# EAGLE design OLC (EAGLE 9.6.2)
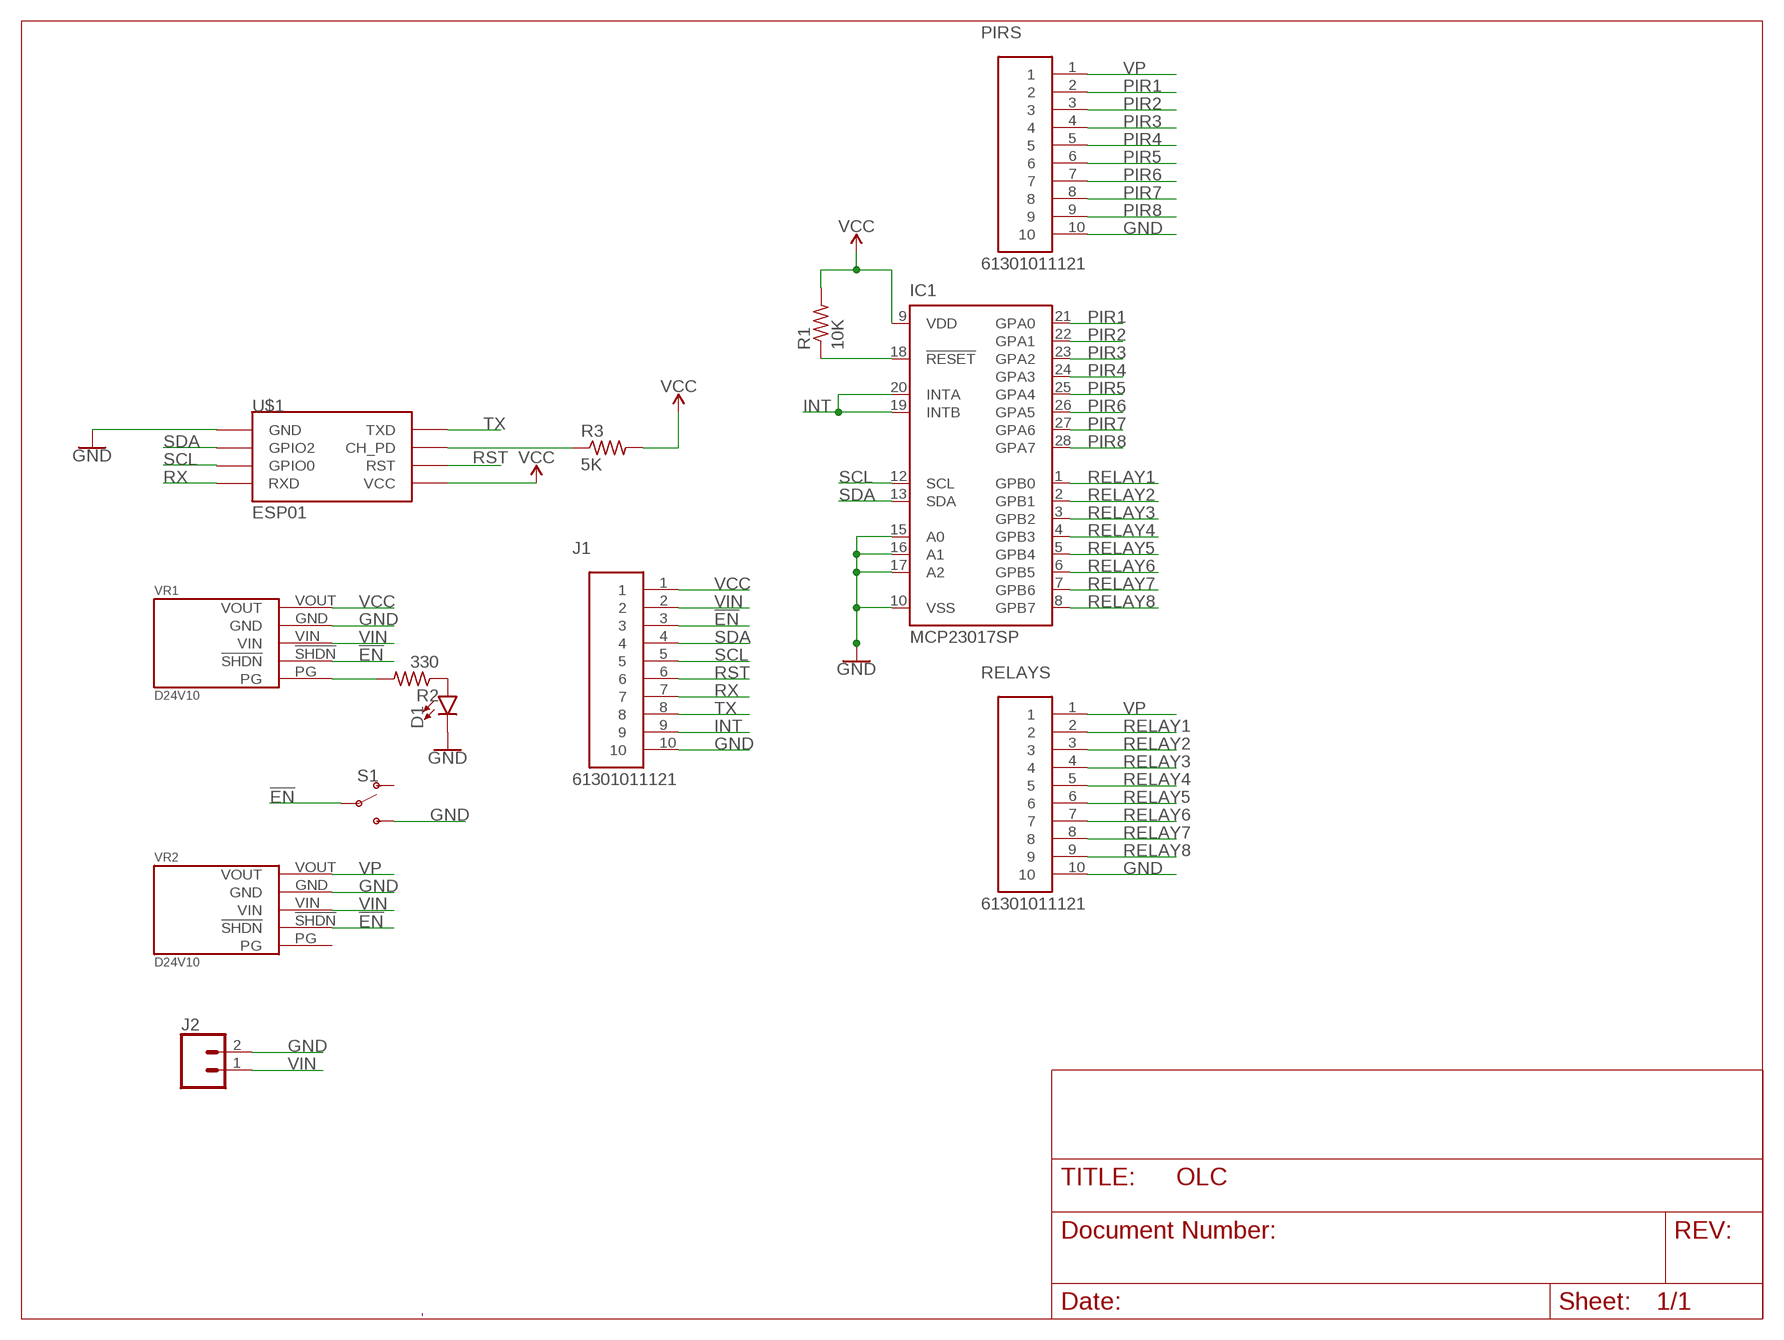
[diagram p0: schematic, sheet 1]

## Parts
D1  LED5MM-KIT  [LED_5MM-KIT]
IC1  MCP23017SP  [DIL28-3]
J1  61301011121  [61301011121]
J2  CONN_023.5MM  [SCREWTERMINAL-3.5MM-2]
PIRS  61301011121  [61301011121]
R1  10K  R-US_0207/10  [0207/10]
R2  330  R-US_0207/10  [0207/10]
R3  5K  R-US_0207/10  [0207/10]
RELAYS  61301011121  [61301011121]
S1  SWITCH-SPDT-PTH-11.6X4.0MM  [SWITCH_SPDT_PTH_11.6X4.0MM]
U$1  ESP01  [ESP01]
VR1  D24V10  [D24V10]
VR2  D24V10  [D24V10]

## Nets
!EN: J1.3 S1.2(P) VR1.!SHDN VR2.!SHDN
GND: D1.K(C) IC1.10(VSS) IC1.15(A0) IC1.16(A1) IC1.17(A2) J1.10 J2.2 PIRS.10 RELAYS.10 S1.3(S) U$1.GND VR1.GND VR2.GND
INT: IC1.19(INTB) IC1.20(INTA) J1.9
N$1: IC1.18(!RESET) R1.1
N$2: D1.A R2.1
N$3: R2.2 VR1.PG
N$11: R3.1 U$1.CH_PD
PIR1: IC1.21(GPA0) PIRS.2
PIR2: IC1.22(GPA1) PIRS.3
PIR3: IC1.23(GPA2) PIRS.4
PIR4: IC1.24(GPA3) PIRS.5
PIR5: IC1.25(GPA4) PIRS.6
PIR6: IC1.26(GPA5) PIRS.7
PIR7: IC1.27(GPA6) PIRS.8
PIR8: IC1.28(GPA7) PIRS.9
RELAY1: IC1.1(GPB0) RELAYS.2
RELAY2: IC1.2(GPB1) RELAYS.3
RELAY3: IC1.3(GPB2) RELAYS.4
RELAY4: IC1.4(GPB3) RELAYS.5
RELAY5: IC1.5(GPB4) RELAYS.6
RELAY6: IC1.6(GPB5) RELAYS.7
RELAY7: IC1.7(GPB6) RELAYS.8
RELAY8: IC1.8(GPB7) RELAYS.9
RST: J1.6 U$1.RST
RX: J1.7 U$1.RX(RXD)
SCL: IC1.12(SCL) J1.5 U$1.GPIO0
SDA: IC1.13(SDA) J1.4 U$1.GPIO2
TX: J1.8 U$1.TX(TXD)
VCC: IC1.9(VDD) J1.1 R1.2 R3.2 U$1.VCC VR1.VOUT
VIN: J1.2 J2.1 VR1.VIN VR2.VIN
VP: PIRS.1 RELAYS.1 VR2.VOUT
Unconnected: S1.1(O) VR2.PG

## Library data of the parts
D1 = SparkFun-LED:LED: LED (Generic) Standard schematic elements and footprints for 5mm, 3mm, 1206, and 0603 sized LEDs. Generic LEDs with no color specified.
IC1 = microchip:MCP23017: http://ww1.microchip.com/downloads/en/DeviceDoc/21952a.pdf Source: http://ww1.microchip.com/downloads/en/DeviceDoc/21952a.pdf; MF: MICROCHIP; MPN: MCP23017-E/SP; OC_FARNELL: 1332088; OC_NEWARK: 31K2959
J1 PIRS RELAYS = Headers:61301011121: CONN HEADER VERT 10POS 2.54MM Manufacturer's datasheet <https://katalog.we-online.de/em/datasheet/6130xx11121.pdf>; CREATED_BY: PCBLayout.com; DIGIKEY_PART_NUMBER: 732-2670-ND; MANUFACTURER: Wurth Electronics Inc.; MPN: 61301011121
J2 = SparkFun-Connectors:CONN_02: Multi connection point. Often used as Generic Header-pin footprint for 0.1 inch spaced/style header connections On any of the 0.1 inch spaced packages, you can populate with these: Break Away Headers - Straight <https://www.sparkfun.com/products/116> (PRT-00116) Break Away Male Headers - Right Angle <https://www.sparkfun.com/products/553> (PRT-00553) Female Headers <https://www.sparkfun.com/products/115> (PRT-00115) Break Away Headers - Machine Pin <https://www.sparkfun.com/products/117> (PRT-00117) Break Away Female Headers - Swiss Machine Pin <https://www.sparkfun.com/products/743> (PRT-00743) For SCREWTERMINALS and SPRING TERMINALS visit here: Screw Terimnals on SparkFun.com <https://www.sparkfun.com/search/results?term=Screw+Terminals> (5mm/3.5mm/2.54mm spacing) This device is also useful as a general connection point to wire up your design to another part of your project. Our various solder wires solder well into these plated through hole pads. Hook-Up Wire - Assortment (Stranded, 22 AWG) <https://www.sparkfun.com/products/11375> (PRT-11375) Hook-Up Wire - Assortment (Solid Core, 22 AWG) <https://www.sparkfun.com/products/11367> (PRT-11367) View the entire wire category on our website here <https://www.sparkfun.com/categories/141> Special notes: Molex polarized connector foot print use with: PRT-08233 with associated crimp pins and housings. 2.54_SCREWTERM for use with PRT-10571. 3.5mm Screw Terminal footprints for PRT-08084 5mm Screw Terminal footprints for use with PRT-08432; PROD_ID: CONN-08399
R1-R3 = resistor:R-US_: RESISTOR, American symbol
S1 = SparkFun-Switches:SWITCH-SPDT: Single Pole, Double Throw (SPDT) Switch Single-pole, double-throw (SPDT) switch. Variant Overview SMD-AYZ0202 Surface Mount DPDT Switch <https://www.sparkfun.com/products/597> (COM-00597) Used on e.g. LilyPad Arduino USB - ATmega32U4 Board <https://www.sparkfun.com/products/12049> PTH-11.6X4.0MM SPDT Mini Power Switch <https://www.sparkfun.com/products/102> (COM-00102) Used on e.g. SparkFun Simon Says - Through-Hole Soldering Kit <https://www.sparkfun.com/products/10547> (KIT-10547) PTH-11.6X4.0MM-KIT KIT version of SPDT Mini Power Switch - Simplifies soldering by removing tStop of switch pins - only one side can be soldered. PTH-11.6X4.0MM-LOCK LOCK version of SPDT Mini Power Switch - Offset pins hold switch in place for easier soldering. SMD-RIGHT-ANGLE Surface Mount Right Angle Switch <https://www.sparkfun.com/products/10860> (COM-10860) Used on e.g. SparkFun ESP8266 Thing <https://www.sparkfun.com/products/13231>; PROD_ID: SWCH-08261; SF_SKU: COM-00102
U$1 = esp8266modules:ESP01: ESP8266 Wifi module 01
VR1 VR2 = Custom Parts:D24V10: Schematic for the D24V10 <https://www.pololu.com/category/248/d24v10fx-step-down-voltage-regulators> series regulators on Pololu <https://pololu.com>.

## Net classes
0 default: width 0.406 mm, clearance 0.203 mm

## Board
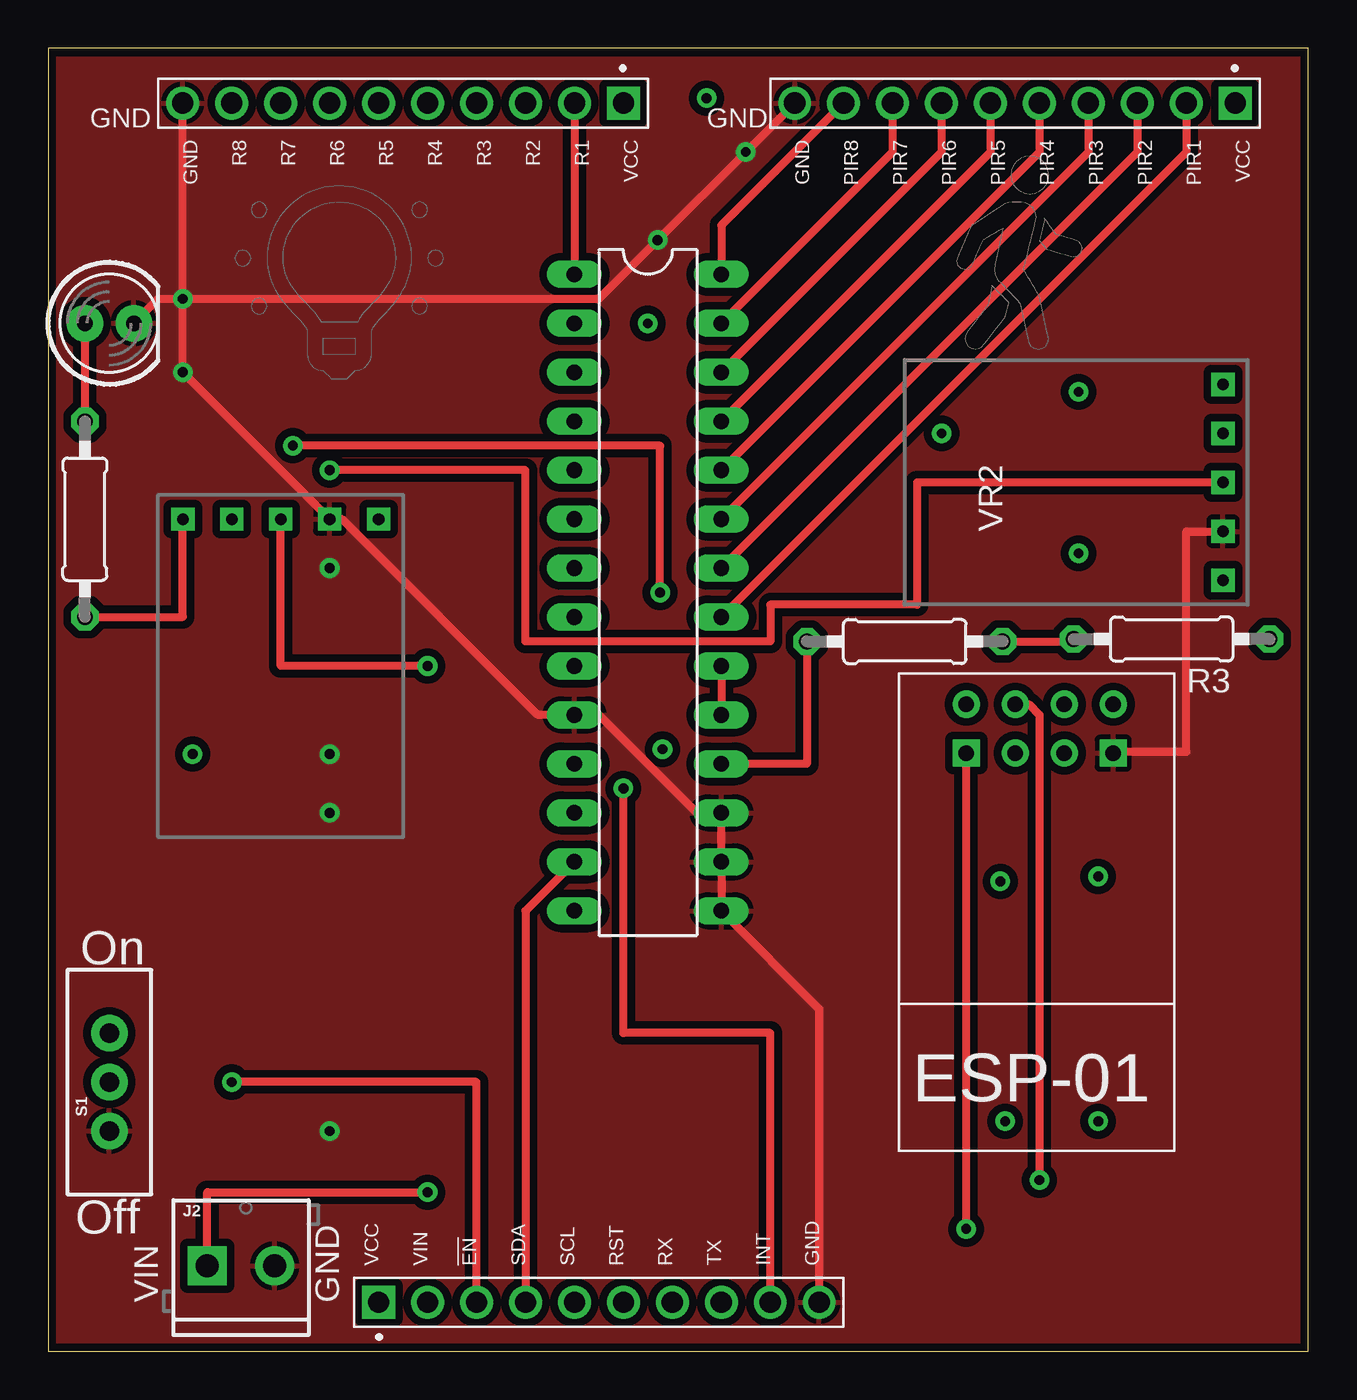
[diagram p1: board, top side]
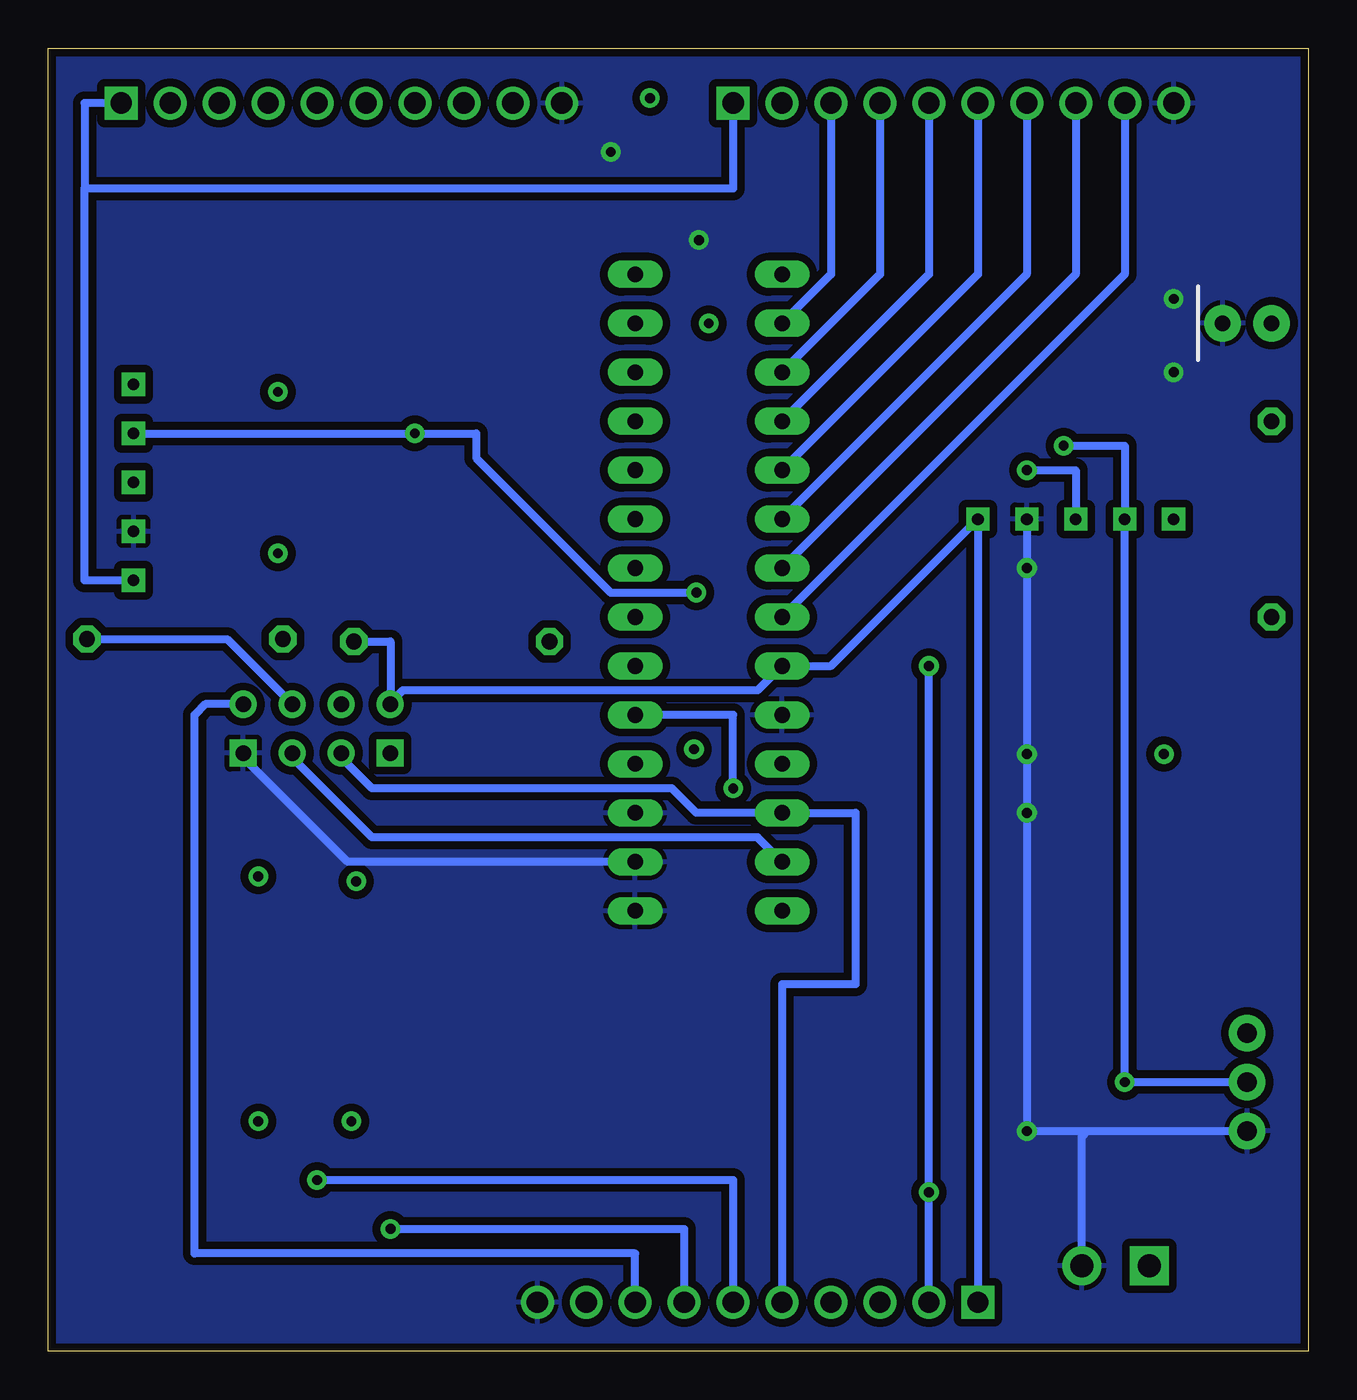
[diagram p2: board, bottom side, seen from below]

Size 65.39 x 67.61 mm. Coordinates in mm from the lower left corner, seen from the top.
Outline: 0,0 65.39,0 65.39,67.61 0,67.61 0,0
Copper layers (1*16): Top 0.035mm / dielectric 1.5mm / Bottom 0.035mm
Design rules "SparkFun": minimum track width 8mil, minimum drill 20mil, track to track 8mil, track to pad 8mil, pad to pad 8mil, via to via 8mil, smd to smd 8mil, copper to edge 8mil, drill to drill 8mil, minimum pad ring 12mil, minimum via ring 10mil, stop-mask expansion 4mil, vias tented up to drill 20mil, thermal gap 10mil

### Footprints (pad centres in the part's own frame; a part is rotated, then mirrored left to right if it is on the bottom)
LED_5MM-KIT = drill 0.813 pad 1.88: A -1.27,0; K 1.27,0
DIL28-3 = drill 0.813 long: 1 -16.51,-3.81; 2 -13.97,-3.81; 3 -11.43,-3.81; 4 -8.89,-3.81; 5 -6.35,-3.81; 6 -3.81,-3.81; 7 -1.27,-3.81; 8 1.27,-3.81; 9 3.81,-3.81; 10 6.35,-3.81; 11 8.89,-3.81; 12 11.43,-3.81; 13 13.97,-3.81; 14 16.51,-3.81; 15 16.51,3.81; 16 13.97,3.81; 17 11.43,3.81; 18 8.89,3.81; 19 6.35,3.81; 20 3.81,3.81; 21 1.27,3.81; 22 -1.27,3.81; 23 -3.81,3.81; 24 -6.35,3.81; 25 -8.89,3.81; 26 -11.43,3.81; 27 -13.97,3.81; 28 -16.51,3.81
61301011121 = drill 1.1 square: 1 -11.43,0 | drill 1.1: 2 -8.89,0; 3 -6.35,0; 4 -3.81,0; 5 -1.27,0; 6 1.27,0; 7 3.81,0; 8 6.35,0; 9 8.89,0; 10 11.43,0
SCREWTERMINAL-3.5MM-2 = drill 1.2 pad 2.032 square: 1 0,0 | drill 1.2 pad 2.032: 2 3.5,0
0207/10 = drill 0.813 octagon: 1 -5.08,0; 2 5.08,0
SWITCH_SPDT_PTH_11.6X4.0MM = drill 1.016 pad 1.88: 1 0,2.54; 2 0,0; 3 0,-2.54
ESP01 = drill 0.8: CH_PD -1.285,-8.178; GPIO0 1.255,-5.638; GPIO2 -1.285,-5.638; RST 1.255,-8.178; TX -3.825,-8.178; VCC 3.795,-8.178 | drill 0.8 square: GND -3.825,-5.638; RX 3.795,-5.638
D24V10 = drill 0.6 square: !SHDN 2.54,-7.62; GND -2.54,-7.62; PG 5.08,-7.62; VIN 0,-7.62; VOUT -5.08,-7.62

### Placement (x,y rotation side)
D1  3.17,53.34 0 top
IC1  31.12,39.37 270 top
J1  28.57,2.54 0 top
J2  8.26,4.45 0 top
PIRS  50.16,64.77 180 top
R1  44.45,36.83 0 top
R2  1.91,43.18 270 top
R3  58.29,36.96 180 top
RELAYS  18.41,64.77 180 top
S1  3.17,13.97 0 top
U$1  51.44,25.4 180 top
VR1  12.07,35.56 180 top
VR2  53.34,45.08 90 top

### Tracks (layer width: path | path; a pad name or v marks a point on that pad's centre or on a via)
!EN  (via drill 0.51)
  Top 0.406: J1.3 22.22,13.97 v9.53,13.97 | v31.75,39.37 31.75,46.99 v12.7,46.99
  Bottom 0.406: S1.2 v9.53,13.97 VR1.!SHDN 9.53,46.99 v12.7,46.99 | VR2.!SHDN v46.35,47.62 43.18,47.62 43.18,46.36 36.2,39.37 v31.75,39.37
GND  (via drill 0.51)
  Top 0.406: J1.10 40,17.78 IC1.15 IC1.16 IC1.17 33.66,27.94 28.57,33.02 IC1.10 25.4,33.02 15.24,43.18 VR1.GND v6.99,50.8 v6.99,54.61 | PIRS.10 v36.2,62.23 v31.62,57.66 28.57,54.61 v6.99,54.61 | D1.K 5.71,54.61 v6.99,54.61 | U$1.GND 55.34,31.12 59.05,31.12 59.05,42.55 VR2.GND | v6.99,54.61 RELAYS.10
  Bottom 0.406: IC1.16 49.85,25.4 55.24,30.8 U$1.GND | VR1.GND v14.61,40.64 v14.61,30.99 v14.61,27.94 v14.61,11.43 11.43,11.43 | 11.43,11.43 S1.3 | J2.2 11.76,11.1 11.43,11.43
  pour Bottom (isolate 0.406): 0.09,67.25 65.09,67.25 65.09,0.25 0.09,0.25
  pour Top (isolate 0.406): 0.09,67.25 65.09,67.25 65.09,0.25 0.09,0.25
INT  (via drill 0.51)
  Top 0.406: IC1.20 IC1.19 | J1.9 37.46,16.51 29.84,16.51 v29.84,29.21
  Bottom 0.406: v29.84,29.21 29.84,33.02 IC1.19
N$1
  Top 0.406: R1.1 39.37,30.48 IC1.18
N$2
  Top 0.406: D1.A R2.1
N$3
  Top 0.406: R2.2 6.99,38.1 VR1.PG
N$4  (via drill 0.51)
  other vias: 31.12,53.34
N$5  (via drill 0.51)
  other vias: 31.88,31.24
N$6  (via drill 0.51)
  other vias: 54.48,24.64
N$7  (via drill 0.51)
  other vias: 49.4,24.38
N$8  (via drill 0.51)
  other vias: 49.66,11.94
N$9  (via drill 0.51)
  other vias: 54.48,11.94
N$10  (via drill 0.51)
  other vias: 7.49,30.99
N$11
  Bottom 0.406: R3.1 56.1,36.96 U$1.CH_PD
N$12  (via drill 0.51)
  other vias: 53.47,41.4
N$13  (via drill 0.51)
  other vias: 53.47,49.78
N$14  (via drill 0.51)
  other vias: 34.16,65.02
PIR1
  Top 0.406: PIRS.2 59.05,62.23 IC1.21
PIR2
  Top 0.406: PIRS.3 56.52,62.23 IC1.22
PIR3
  Top 0.406: IC1.23 53.98,62.23 PIRS.4
PIR4
  Top 0.406: IC1.24 51.44,62.23 PIRS.5
PIR5
  Top 0.406: IC1.25 48.89,62.23 PIRS.6
PIR6
  Top 0.406: IC1.26 46.35,62.23 PIRS.7
PIR7
  Top 0.406: IC1.27 43.81,62.23 PIRS.8
PIR8
  Top 0.406: IC1.28 34.92,58.42 PIRS.9
RELAY1
  Top 0.406: RELAYS.2 IC1.1
RELAY2
  Bottom 0.406: IC1.2 24.77,55.88 RELAYS.3
RELAY3
  Bottom 0.406: IC1.3 22.22,55.88 RELAYS.4
RELAY4
  Bottom 0.406: IC1.4 19.68,55.88 RELAYS.5
RELAY5
  Bottom 0.406: IC1.5 17.14,55.88 RELAYS.6
RELAY6
  Bottom 0.406: IC1.6 14.61,55.88 RELAYS.7
RELAY7
  Bottom 0.406: IC1.7 12.07,55.88 RELAYS.8
RELAY8
  Bottom 0.406: IC1.8 9.53,55.88 RELAYS.9
RST  (via drill 0.51)
  Top 0.406: U$1.RST 50.88,33.58 51.44,33.02 v51.44,8.89
  Bottom 0.406: J1.6 29.84,8.89 v51.44,8.89
RX  (via drill 0.51)
  Top 0.406: U$1.RX 47.62,31.02 v47.62,6.35
  Bottom 0.406: v47.62,6.35 32.38,6.35 J1.7
SCL
  Bottom 0.406: U$1.GPIO0 50.16,30.8 48.58,29.21 33.02,29.21 31.75,27.94 IC1.12 23.49,27.94 23.49,19.05 27.3,19.05 J1.5
SDA
  Top 0.406: J1.4 24.77,22.86 IC1.13
  Bottom 0.406: IC1.13 28.57,26.67 48.58,26.67 52.7,30.8 U$1.GPIO2
TX
  Bottom 0.406: U$1.TX 57.23,33.58 57.78,33.02 57.78,5.08 34.92,5.08 J1.8
VCC
  Top 0.406: R1.2 53.09,36.83 R3.2
  Bottom 0.406: J1.1 VR1.VOUT 24.77,35.56 IC1.9 28.57,34.29 46.99,34.29 47.62,33.66 U$1.VCC 47.62,33.59 47.62,36.83 R1.2
VIN  (via drill 0.51)
  Top 0.406: v19.68,35.56 12.07,35.56 VR1.VIN | VR2.VIN 45.09,45.08 45.09,38.73 37.46,38.73 37.46,36.83 24.77,36.83 24.77,45.72 v14.61,45.72 | J2.1 8.26,8.26 v19.68,8.26
  Bottom 0.406: J1.2 v19.68,8.26 v19.68,35.56 | v14.61,45.72 12.07,45.72 VR1.VIN
VP
  Bottom 0.406: RELAYS.1 29.84,60.33 63.5,60.33 | VR2.VOUT 63.5,40 63.5,60.33 | 63.5,60.33 63.5,64.77 PIRS.1

### Text on the board
tPlace: GND | GND | R8 | R7 | R6 | R5 | R4 | R3 | R2 | R1 | VCC | GND | GND | PIR8 | PIR7 | PIR6 | PIR5 | PIR4 | PIR3 | PIR2 | PIR1 | VCC | On | Off | VCC | VIN | !EN | SDA | SCL | RST | RX | TX | INT | GND | VIN | GND